# EAGLE design glove-shield (EAGLE 9.6.2)

## Sheet 1 of 3
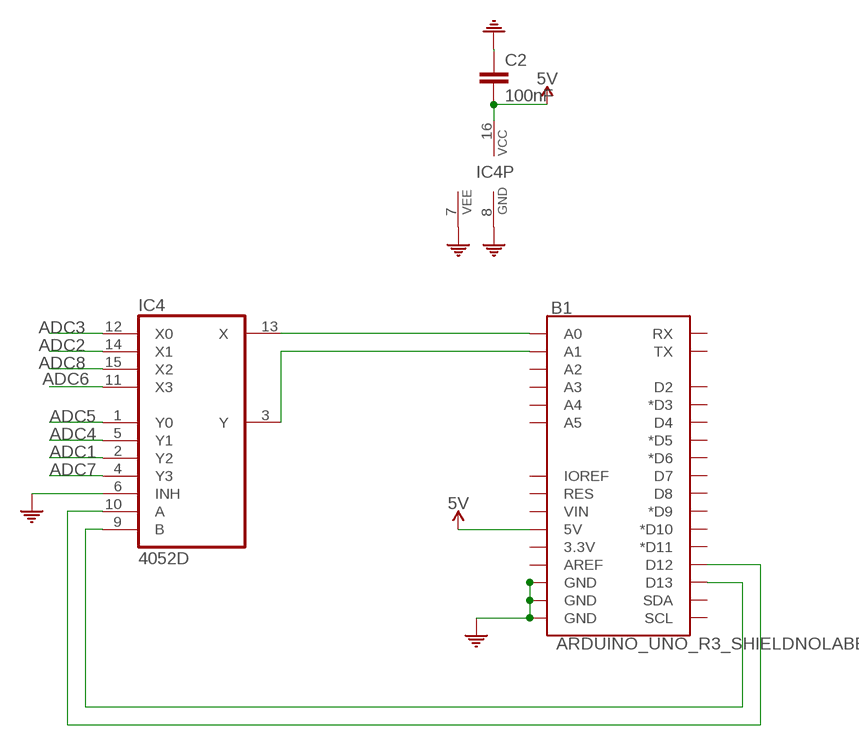
[diagram p0: schematic, sheet 1]

### Parts
B1  ARDUINO_UNO_R3_SHIELDNOLABELS  [UNO_R3_SHIELD_NOLABELS]
C2  100nF  0015_100NF_0603  [C0603-ROUND]
IC4  4052D  [SO16]

### Nets
5V: B1.5V C2.2 IC4.16(VCC) ; also sheet 2
ADC1: IC4.2(Y2) ; also sheet 2
ADC2: IC4.14(X1) ; also sheet 2
ADC3: IC4.12(X0) ; also sheet 2
ADC4: IC4.5(Y1) ; also sheet 2
ADC5: IC4.1(Y0) ; also sheet 2
ADC6: IC4.11(X3) ; also sheet 2
ADC7: IC4.4(Y3) ; also sheet 2
ADC8: IC4.15(X2) ; also sheet 2
COM: B1.GND@0(GND) B1.GND@1(GND) B1.GND@2(GND) C2.1 IC4.6(INH) IC4.7(VEE) IC4.8(GND) ; also sheet 2
N$1: B1.D13 IC4.9(B)
N$9: B1.A0 IC4.13(X)
N$26: B1.A1 IC4.3(Y)
N$31: B1.D12 IC4.10(A)
Unconnected: B1.3.3V B1.A2 B1.A3 B1.A4 B1.A5 B1.AREF B1.D2 B1.D3(*D3) B1.D4 B1.D5(*D5) B1.D6(*D6) B1.D7 B1.D8 B1.D9(*D9) B1.D10(*D10) B1.D11(*D11) B1.IOREF B1.RES B1.RX B1.SCL B1.SDA B1.TX B1.VIN

## Sheet 2 of 3
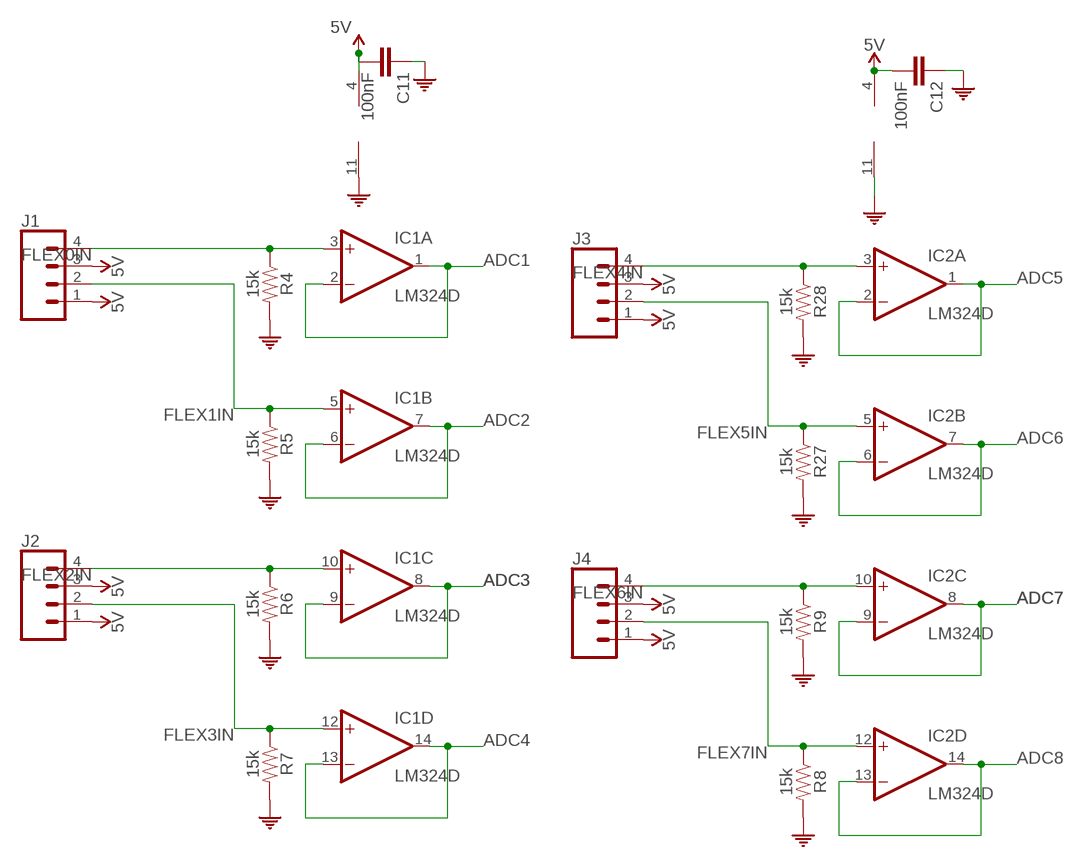
[diagram p1: schematic, sheet 2]

### Parts
C11  100nF  0015_100NF_0603  [C0603-ROUND]
C12  100nF  0015_100NF_0603  [C0603-ROUND]
IC1  LM324D  [SO14]
IC2  LM324D  [SO14]
J1  CONN_04JST-PTH  [JST-4-PTH]
J2  CONN_04JST-PTH  [JST-4-PTH]
J3  CONN_04JST-PTH  [JST-4-PTH]
J4  CONN_04JST-PTH  [JST-4-PTH]
R4  15k  RESISTOR0603  [0603]
R5  15k  RESISTOR0603  [0603]
R6  15k  RESISTOR0603  [0603]
R7  15k  RESISTOR0603  [0603]
R8  15k  RESISTOR0603  [0603]
R9  15k  RESISTOR0603  [0603]
R27  15k  RESISTOR0603  [0603]
R28  15k  RESISTOR0603  [0603]

### Nets
5V: C11.2 C12.2 IC1.4(P:V+) IC2.4(P:V+) J1.1 J1.3 J2.1 J2.3 J3.1 J3.3 J4.1 J4.3 ; also sheet 1
ADC1: IC1.1(A:OUT) IC1.2(A:-IN) ; also sheet 1
ADC2: IC1.6(B:-IN) IC1.7(B:OUT) ; also sheet 1
ADC3: IC1.8(C:OUT) IC1.9(C:-IN) ; also sheet 1
ADC4: IC1.13(D:-IN) IC1.14(D:OUT) ; also sheet 1
ADC5: IC2.1(A:OUT) IC2.2(A:-IN) ; also sheet 1
ADC6: IC2.6(B:-IN) IC2.7(B:OUT) ; also sheet 1
ADC7: IC2.8(C:OUT) IC2.9(C:-IN) ; also sheet 1
ADC8: IC2.13(D:-IN) IC2.14(D:OUT) ; also sheet 1
COM: C11.1 C12.1 IC1.11(P:V-) IC2.11(P:V-) R4.2 R5.2 R6.2 R7.2 R8.2 R9.2 R27.2 R28.2 ; also sheet 1
FLEX0IN: IC1.3(A:+IN) J1.4 R4.1
FLEX1IN: IC1.5(B:+IN) J1.2 R5.1
FLEX2IN: IC1.10(C:+IN) J2.4 R6.1
FLEX3IN: IC1.12(D:+IN) J2.2 R7.1
FLEX4IN: IC2.3(A:+IN) J3.4 R28.1
FLEX5IN: IC2.5(B:+IN) J3.2 R27.1
FLEX6IN: IC2.10(C:+IN) J4.4 R9.1
FLEX7IN: IC2.12(D:+IN) J4.2 R8.1

## Sheet 3 of 3

## Library data of the parts
B1 = SparkFun-Boards:ARDUINO_UNO_R3_SHIELD: Arduino R3 Shield Footprint Shield form compatible with the Arduino Uno R3. SparkFun Products: MG2639 Cellular Shield <https://www.sparkfun.com/products/13120> MIDI Shield <https://www.sparkfun.com/products/12898> R3 Stackable Headers Kit <https://www.sparkfun.com/products/11417>
C2 C11 C12 = Condensatori:0015_100NF_0603: 100nF 0603 50V; CASE: 0603; MONTHLY_USAGE: _____; PART_NUMBER: cl10b104kbnc; PRICE: _____; SUPPLIER: _____; TYPE: Condensatori
IC1 IC2 = linear:LM324: OP AMP
IC4 = 40xx:4052: Dual 4-channel ANALOG MULTIPLEXER
J1-J4 = SparkFun-Connectors:CONN_04: Multi connection point. Often used as Generic Header-pin footprint for 0.1 inch spaced/style header connections On any of the 0.1 inch spaced packages, you can populate with these: Break Away Headers - Straight <https://www.sparkfun.com/products/116> (PRT-00116) Break Away Male Headers - Right Angle <https://www.sparkfun.com/products/553> (PRT-00553) Female Headers <https://www.sparkfun.com/products/115> (PRT-00115) Break Away Headers - Machine Pin <https://www.sparkfun.com/products/117> (PRT-00117) Break Away Female Headers - Swiss Machine Pin <https://www.sparkfun.com/products/743> (PRT-00743) For SCREWTERMINALS and SPRING TERMINALS visit here: Screw Terimnals on SparkFun.com <https://www.sparkfun.com/search/results?term=Screw+Terminals> (5mm/3.5mm/2.54mm spacing) This device is also useful as a general connection point to wire up your design to another part of your project. Our various solder wires solder well into these plated through hole pads. Hook-Up Wire - Assortment (Stranded, 22 AWG) <https://www.sparkfun.com/products/11375> (PRT-11375) Hook-Up Wire - Assortment (Solid Core, 22 AWG) <https://www.sparkfun.com/products/11367> (PRT-11367) View the entire wire category on our website here <https://www.sparkfun.com/categories/141> Special notes: Molex polarized connector foot print use with SKU : PRT-08231 with associated crimp pins and housings. 1MM SMD Version SKU: PRT-10208; PROD_ID: WIRE-13531; SF_ID: PRT-09916
R4-R9 R27 R28 = SparkFun-Resistors:RESISTOR: Generic Resistor Package

## Board
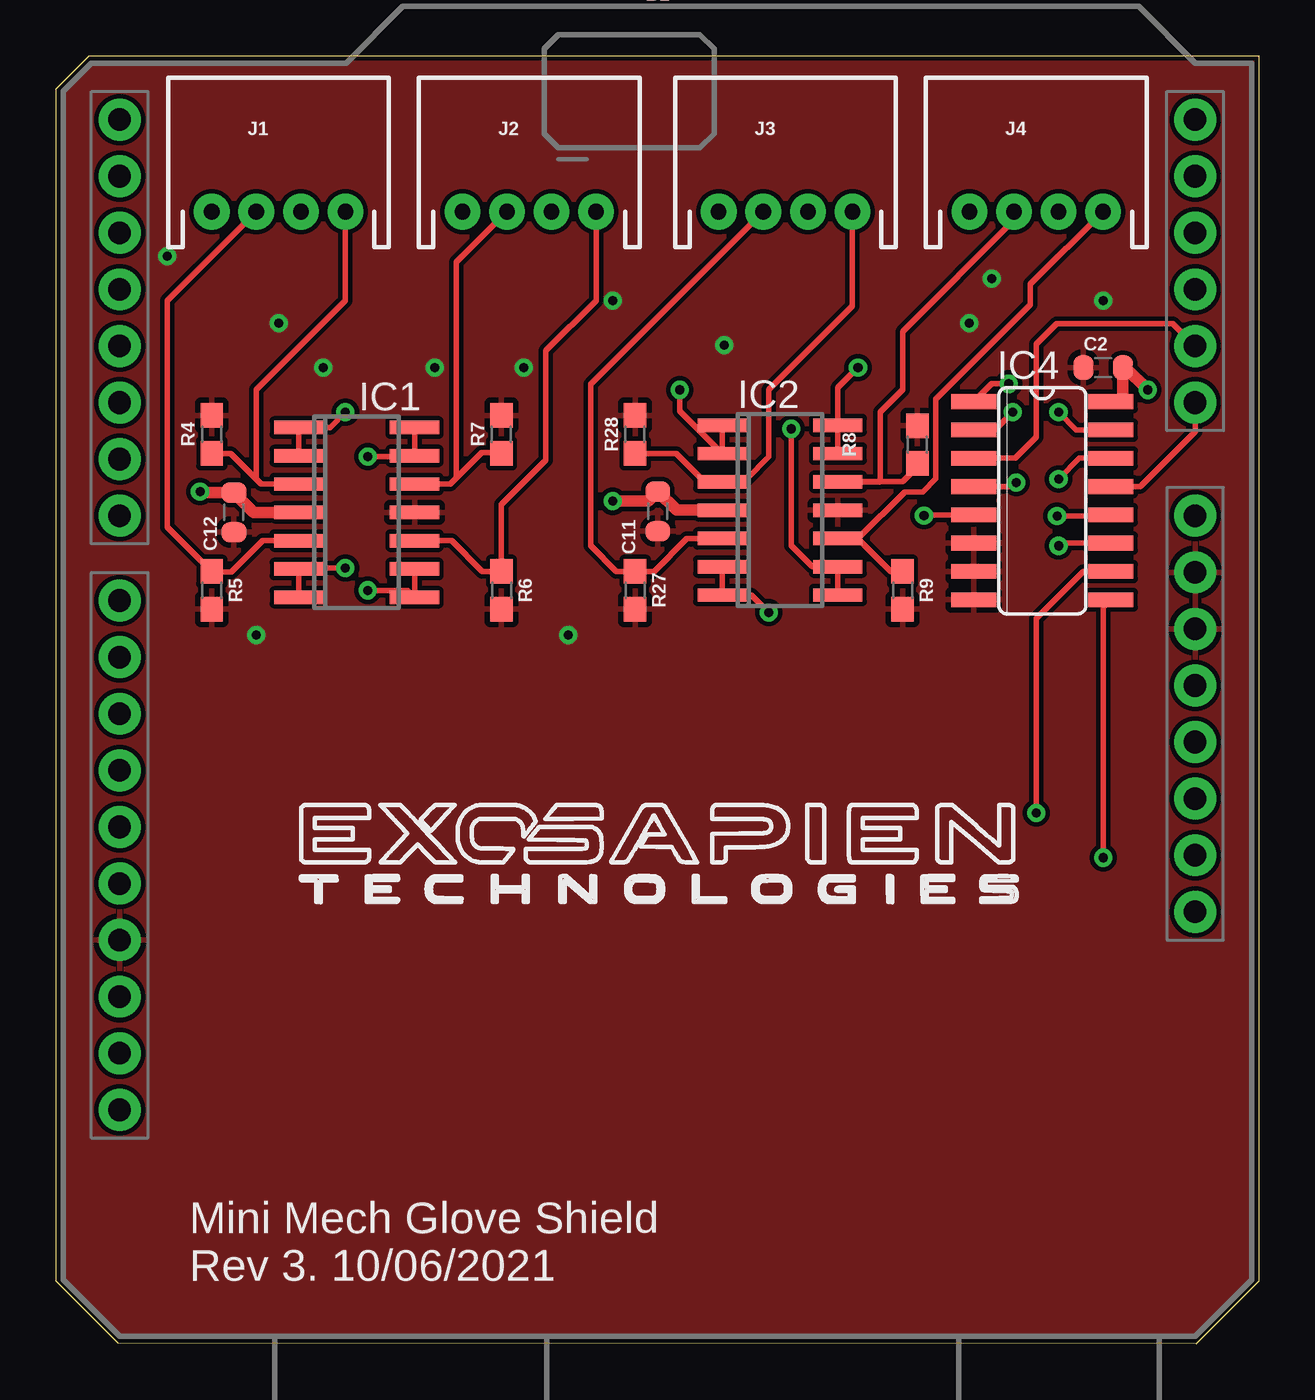
[diagram p2: board, top side]
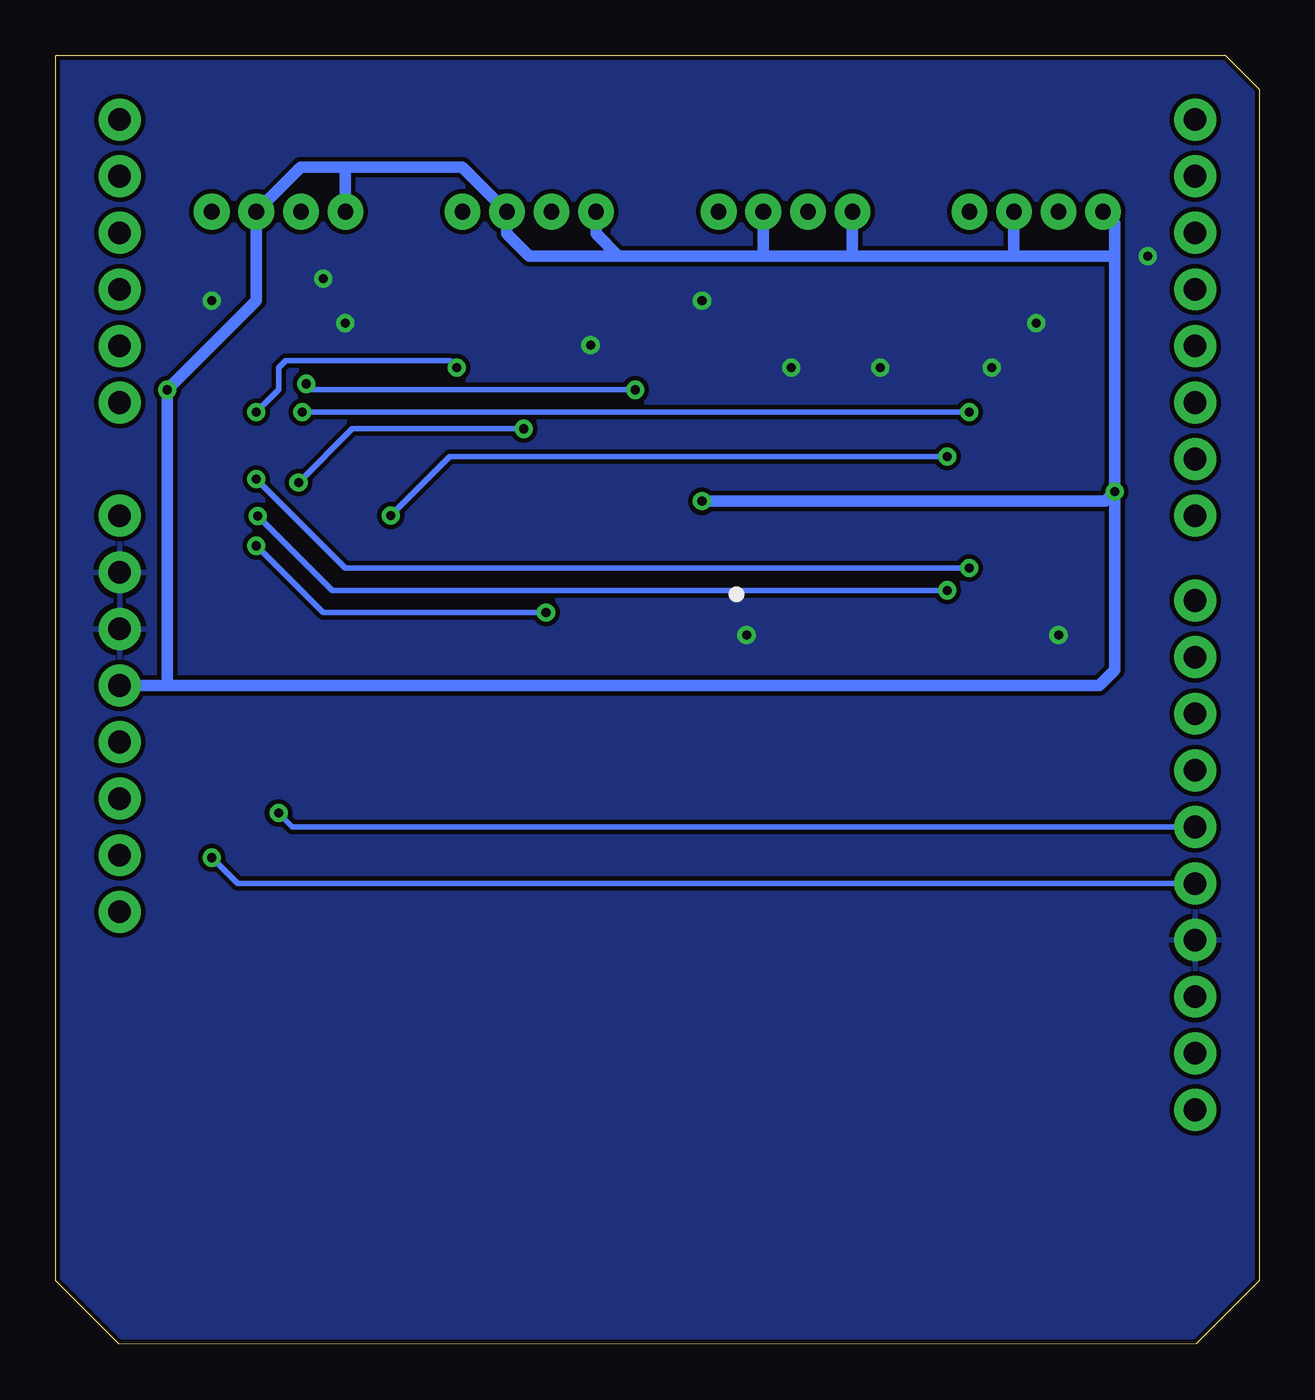
[diagram p3: board, bottom side, seen from below]

Size 54 x 57.82 mm. Coordinates in mm from the lower left corner, seen from the top.
Outline: 0,56.32 0,2.82 2.8,0.03 51.18,0 54,2.82 54,57.82 1.5,57.82 0,56.32
Copper layers (1*16): Top 0.035mm / dielectric 1.5mm / Bottom 0.035mm
Design rules "default *": minimum track width 10mil, minimum drill 16mil, track to track 8mil, track to pad 8mil, pad to pad 8mil, via to via 8mil, smd to smd 8mil, copper to edge 8mil, drill to drill 8mil, minimum pad ring 12mil, minimum via ring 8mil, stop-mask expansion 0mil, vias tented up to drill 24mil, thermal gap 10mil

### Footprints (pad centres in the part's own frame; a part is rotated, then mirrored left to right if it is on the bottom)
UNO_R3_SHIELD_NOLABELS = drill 1.016 pad 1.88: 3.3V 24.13,-3.81; 5V 24.13,-1.27; A0 24.13,11.43; A1 24.13,13.97; A2 24.13,16.51; A3 24.13,19.05; A4 24.13,21.59; A5 24.13,24.13; AREF -24.13,-15.24; D2 -24.13,19.05; D3 -24.13,16.51; D4 -24.13,13.97; D5 -24.13,11.43; D6 -24.13,8.89; D7 -24.13,6.35; D8 -24.13,2.54; D9 -24.13,0; D10 -24.13,-2.54; D11 -24.13,-5.08; D12 -24.13,-7.62; D13 -24.13,-10.16; GND@0 24.13,1.27; GND@1 24.13,3.81; GND@2 -24.13,-12.7; IOREF 24.13,-8.89; NC 24.13,-11.43; RES 24.13,-6.35; RX -24.13,24.13; SCL -24.13,-20.32; SDA -24.13,-17.78; TX -24.13,21.59; VIN 24.13,6.35
C0603-ROUND = smd 0.898 x 1.1: 1 -0.889,0; 2 0.889,0
SO14 = smd 0.6 x 2.2: 1 -3.81,-2.6; 2 -2.54,-2.6; 3 -1.27,-2.6; 4 0,-2.6; 5 1.27,-2.6; 6 2.54,-2.6; 7 3.81,-2.6; 8 3.81,2.6; 9 2.54,2.6; 10 1.27,2.6; 11 0,2.6; 12 -1.27,2.6; 13 -2.54,2.6; 14 -3.81,2.6
SO16 = smd 0.66 x 2.032: 1 -4.445,-3.073; 2 -3.175,-3.073; 3 -1.905,-3.073; 4 -0.635,-3.073; 5 0.635,-3.073; 6 1.905,-3.073; 7 3.175,-3.073; 8 4.445,-3.073; 9 4.445,3.073; 10 3.175,3.073; 11 1.905,3.073; 12 0.635,3.073; 13 -0.635,3.073; 14 -1.905,3.073; 15 -3.175,3.073; 16 -4.445,3.073
JST-4-PTH = drill 0.7 pad 1.6: 1 -3,0; 2 -1,0; 3 1,0; 4 3,0
0603 = smd 1.1 x 1: 1 -0.85,0; 2 0.85,0

### Placement (x,y rotation side)
B1  27,30.82 0 top
C2  47,43.82 0 top
C11  27.03,37.37 90 top
C12  8,37.32 90 top
IC1  13.5,37.32 270 top
IC2  32.5,37.42 270 top
IC4  44.27,37.85 270 top
J1  10,50.82 0 top
J2  21.25,50.82 0 top
J3  32.75,50.82 0 top
J4  44,50.82 0 top
R4  7,40.82 90 top
R5  7,33.82 270 top
R6  20,33.82 270 top
R7  20,40.82 90 top
R8  38.67,40.37 90 top
R9  38,33.82 270 top
R27  26,33.82 270 top
R28  26,40.82 90 top

### Tracks (layer width: path | path; a pad name or v marks a point on that pad's centre or on a via)
5V  (via drill 0.41)
  Top 0.254: 10.74,37.39 IC1.4
  Top 0.508: 10.74,37.39 10.68,37.32 8.89,37.32 C12.2 6.47,38.21 6.45,38.23 v6.48,38.25 | IC2.4 27.86,37.42 C11.2 26.59,37.82 v25,37.82 | IC4.16 47.83,42.29 47.9,42.37 47.89,42.38 C2.2 48,43.82 v49,42.82
  Bottom 0.508: v25,37.82 6.91,37.82 v6.48,38.25 | v6.48,38.25 6.48,48.82 | 6.48,48.82 6.48,50.3 J1.1 | J1.3 11,48.82 | 11,48.82 6.48,48.82 | 11,48.82 18.25,48.82 | 18.25,48.82 J2.1 | 18.25,48.82 22.25,48.82 | 22.25,48.82 J2.3 | 22.25,48.82 28.75,48.82 | J3.1 29.75,49.82 28.75,48.82 | 28.75,48.82 32.75,48.82 33.75,49.82 J3.3 35.75,52.82 41,52.82 | 41,52.82 J4.1 | 41,52.82 43,52.82 J4.3 45,46.82 v49,42.82 49,29.55 | B1.5V 49,29.55 | 49,29.55 7.18,29.55 6.48,30.25 v6.48,38.25
ADC1  (via drill 0.41)
  Top 0.254: IC1.2 IC1.1 12.31,41.13 v13,41.82 | IC4.2 42.14,41.02 42.47,41.35 42.65,41.53 v42.94,41.82
  Bottom 0.254: v13,41.82 v42.94,41.82
ADC2  (via drill 0.41)
  Top 0.254: IC1.7 IC1.6 10.94,34.82 v13,34.82 | IC4.14 45.93,39.75 v45,38.82
  Bottom 0.254: v45,38.82 41,34.82 v13,34.82
ADC3  (via drill 0.41)
  Top 0.254: IC1.9 IC1.8 15.79,33.82 v14,33.82 | v44.93,37.16 47.3,37.16 IC4.12
  Bottom 0.254: v44.93,37.16 41.59,33.82 v14,33.82
ADC4  (via drill 0.41)
  Top 0.254: IC1.14 IC1.13 16.06,39.82 v14,39.82 | v38.96,37.19 38.99,37.21 IC4.5
  Bottom 0.254: v38.96,37.19 36.33,39.82 v14,39.82
ADC5  (via drill 0.41)
  Top 0.254: IC2.1 IC2.2 28,41.86 v28,42.82 | IC4.1 42,43.09 v42.77,43.09
  Bottom 0.254: v28,42.82 42.49,42.82 v42.77,43.09
ADC6  (via drill 0.41)
  Top 0.254: IC2.6 IC2.7 31.21,33.61 v32,32.82 | v45,35.82 45.12,35.94 IC4.11
  Bottom 0.254: v32,32.82 42,32.82 v45,35.82
ADC7  (via drill 0.41)
  Top 0.254: IC2.8 IC2.9 33.94,34.88 33,35.82 v33,41.07 | v43.1,38.66 42.98,38.66 42.8,38.48 IC4.4
  Bottom 0.254: v43.1,38.66 40.69,41.07 v33,41.07
ADC8  (via drill 0.41)
  Top 0.254: v36,43.82 35.1,42.92 IC2.14 IC2.13 | IC4.15 45.8,41.02 v45,41.82
  Bottom 0.254: v45,41.82 44,42.82 44,43.82 43.68,44.15 36.32,44.15 v36,43.82
COM  (via drill 0.41)
  other vias: 47,46.82 30,44.82 25,46.82 21,43.82 17,43.82 12,43.82 10,45.82 5,48.82 9,31.82 23,31.82 42,47.82 41,45.82
  pour Top (isolate 0.203): -0.55,61.12 54.7,61.12 54.7,-3.27 -0.55,-3.39
  pour Bottom (isolate 0.203): -0.55,61.37 54.65,61.37 54.65,-3.28 -0.55,-3.41
FLEX0IN
  Top 0.254: IC1.3 9.23,38.59 9,38.82 | R4.1 7.85,39.97 9,38.82 | J1.4 13,46.82 9,42.82 9,38.82
FLEX1IN
  Top 0.254: IC1.5 9.28,36.05 7.87,34.65 7.03,34.65 R5.1 5,36.67 5,46.82 J1.2
FLEX2IN
  Top 0.254: IC1.10 17.77,36.05 19.15,34.67 R6.1 20,37.67 22,39.67 22,44.57 24.25,46.82 J2.4
FLEX3IN
  Top 0.254: IC1.12 17.71,38.59 17.97,38.85 | 17.97,38.85 19.13,40.01 19.97,40.01 R7.1 | 17.97,38.85 17.97,48.56 20.23,50.82 J2.2
FLEX4IN
  Top 0.254: J3.4 35.75,46.57 32,42.82 32,39.82 31,38.82 30,38.82 30,38.79 IC2.3 29.13,38.69 27.85,39.97 R28.1
FLEX5IN
  Top 0.254: J3.2 24,43.07 24,35.82 25.15,34.67 R27.1 26.85,34.67 28.32,36.14 IC2.5
FLEX6IN
  Top 0.254: 36,36.14 IC2.10 | J4.4 43.74,47.56 43.74,46.64 39.5,42.41 39.5,38.83 38.91,38.24 38.09,38.24 36,36.14 | R9.1 37.47,34.67 36,36.14
FLEX7IN
  Top 0.254: J4.2 43,50.44 38,45.44 38,42.82 37,41.82 37,38.73 36.96,38.69 35.87,38.69 | 35.87,38.69 35.88,38.7 | R8.1 38.67,39.37 38,38.7 IC2.12 35.87,38.69
N$1  (via drill 0.41)
  Top 0.254: v47,21.82 47,33.06 IC4.9
  Bottom 0.254: B1.D13 45.84,20.66 v47,21.82
N$9
  Top 0.254: IC4.13 48.66,38.48 51.13,40.95 B1.A0
N$26
  Top 0.254: B1.A1 50.13,45.79 44.93,45.79 44,44.86 44,40.7 43.06,39.75 IC4.3
N$31  (via drill 0.41)
  Top 0.254: IC4.10 46.12,34.67 44,32.55 v44,23.82
  Bottom 0.254: v44,23.82 43.38,23.2 B1.D12

### Text on the board
tNames: Mini Mech Glove Shield / Rev 3. 10/06/2021
test-probe: NANO / TEST POINTS | 10 | 9 | 8 | 7 | 6 | 5 | 4 | 3 | 2 | GND1 | RESET | 0 | 1 | USB_D- | USB_D+ | USB_GND | ISP1_5 | ISP1_4 | ISP1_3 | USB_5V | ISP1_1 | 3V3 | AREF | A0 | A1 | A2 | A3 | A4 | A5 | A6 | A7 | 5V_REF | DC_VIN- | DC_VIN+